# Altium project PCB_Project1.PrjPCB
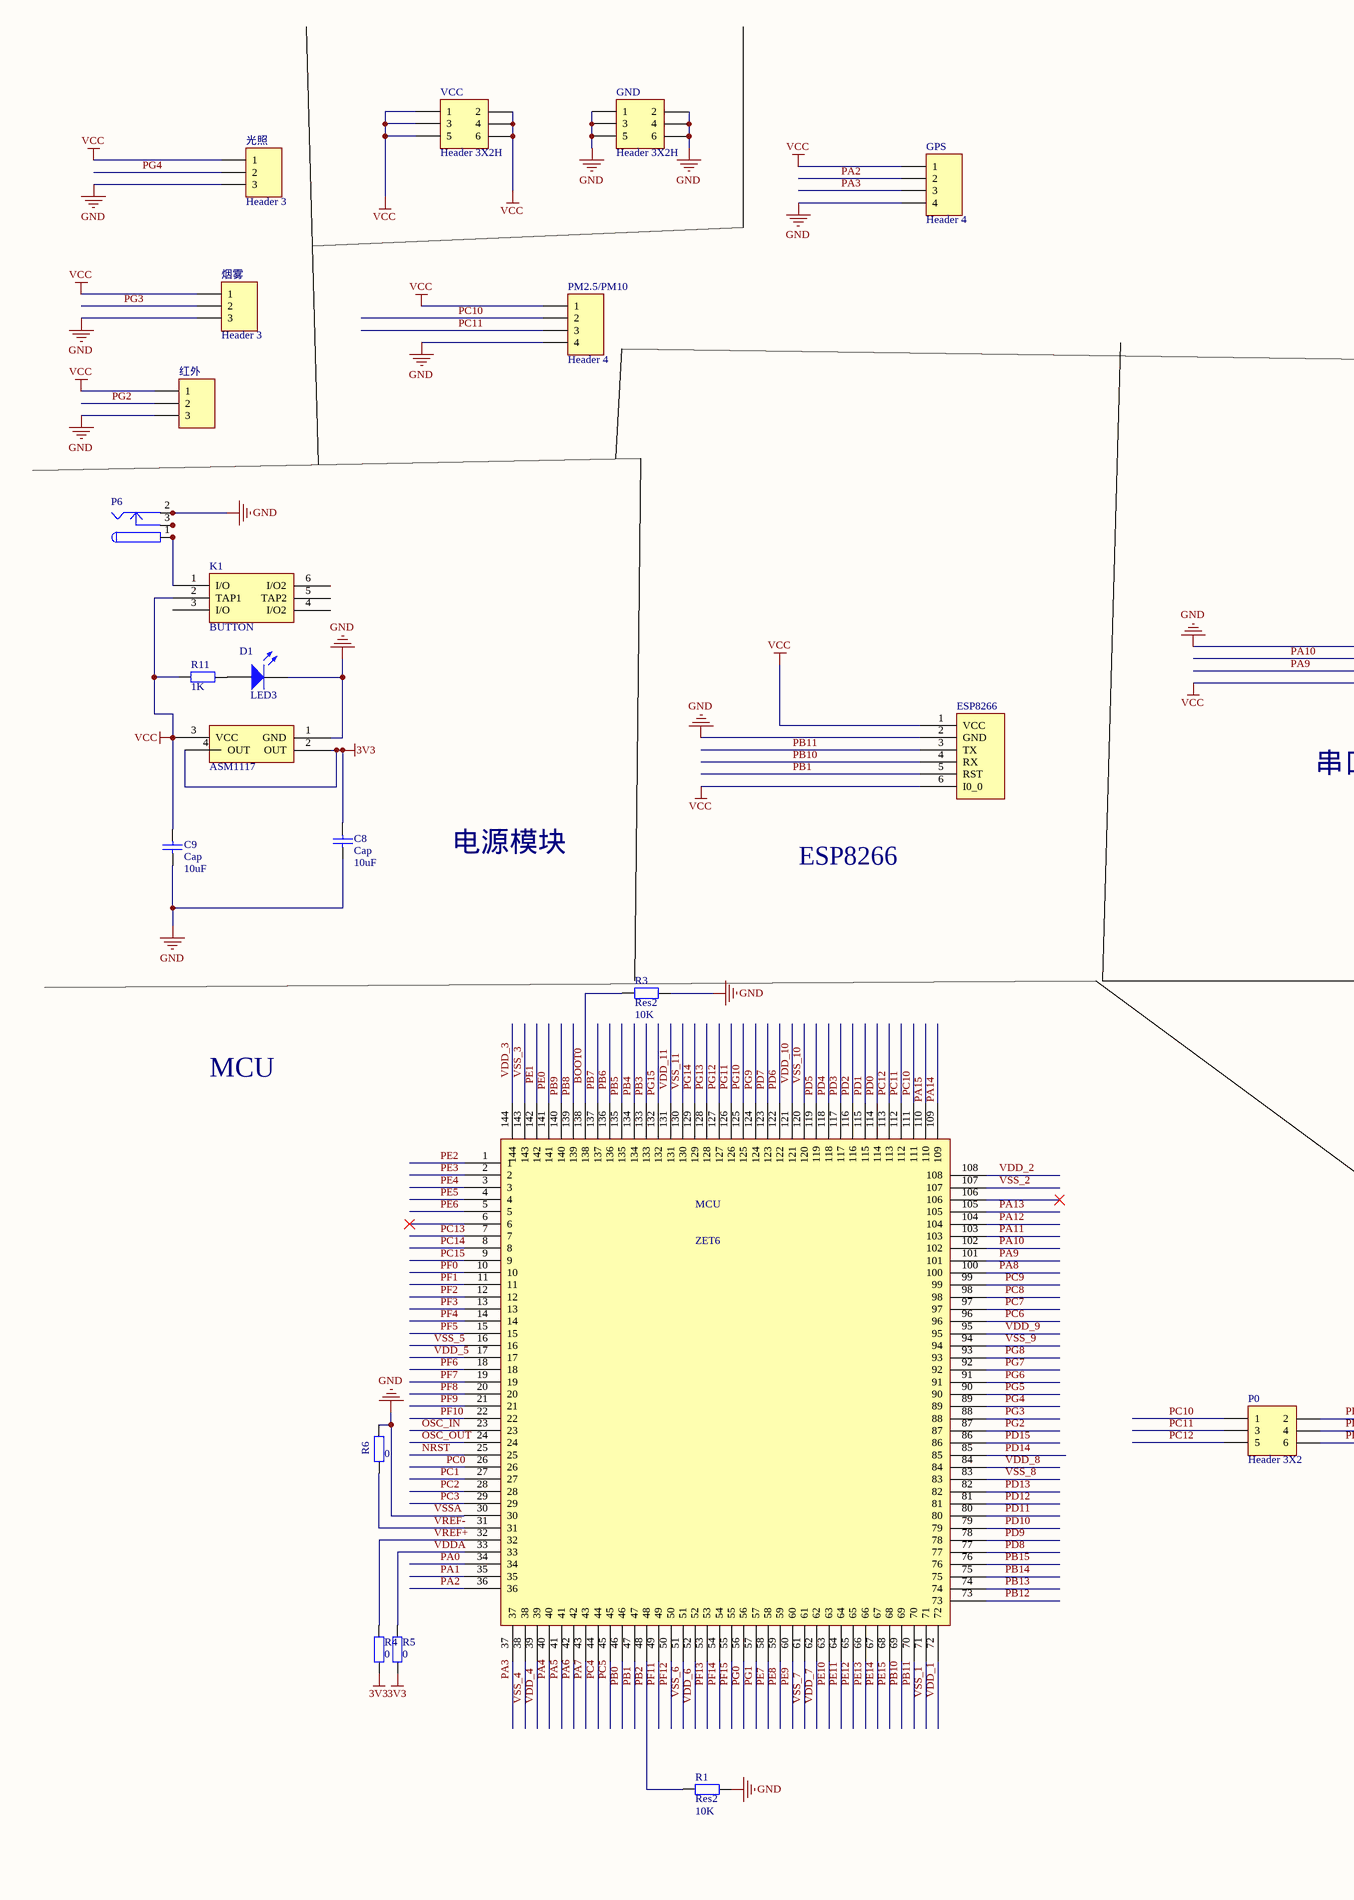
[diagram p0: 1.SchDoc, left]
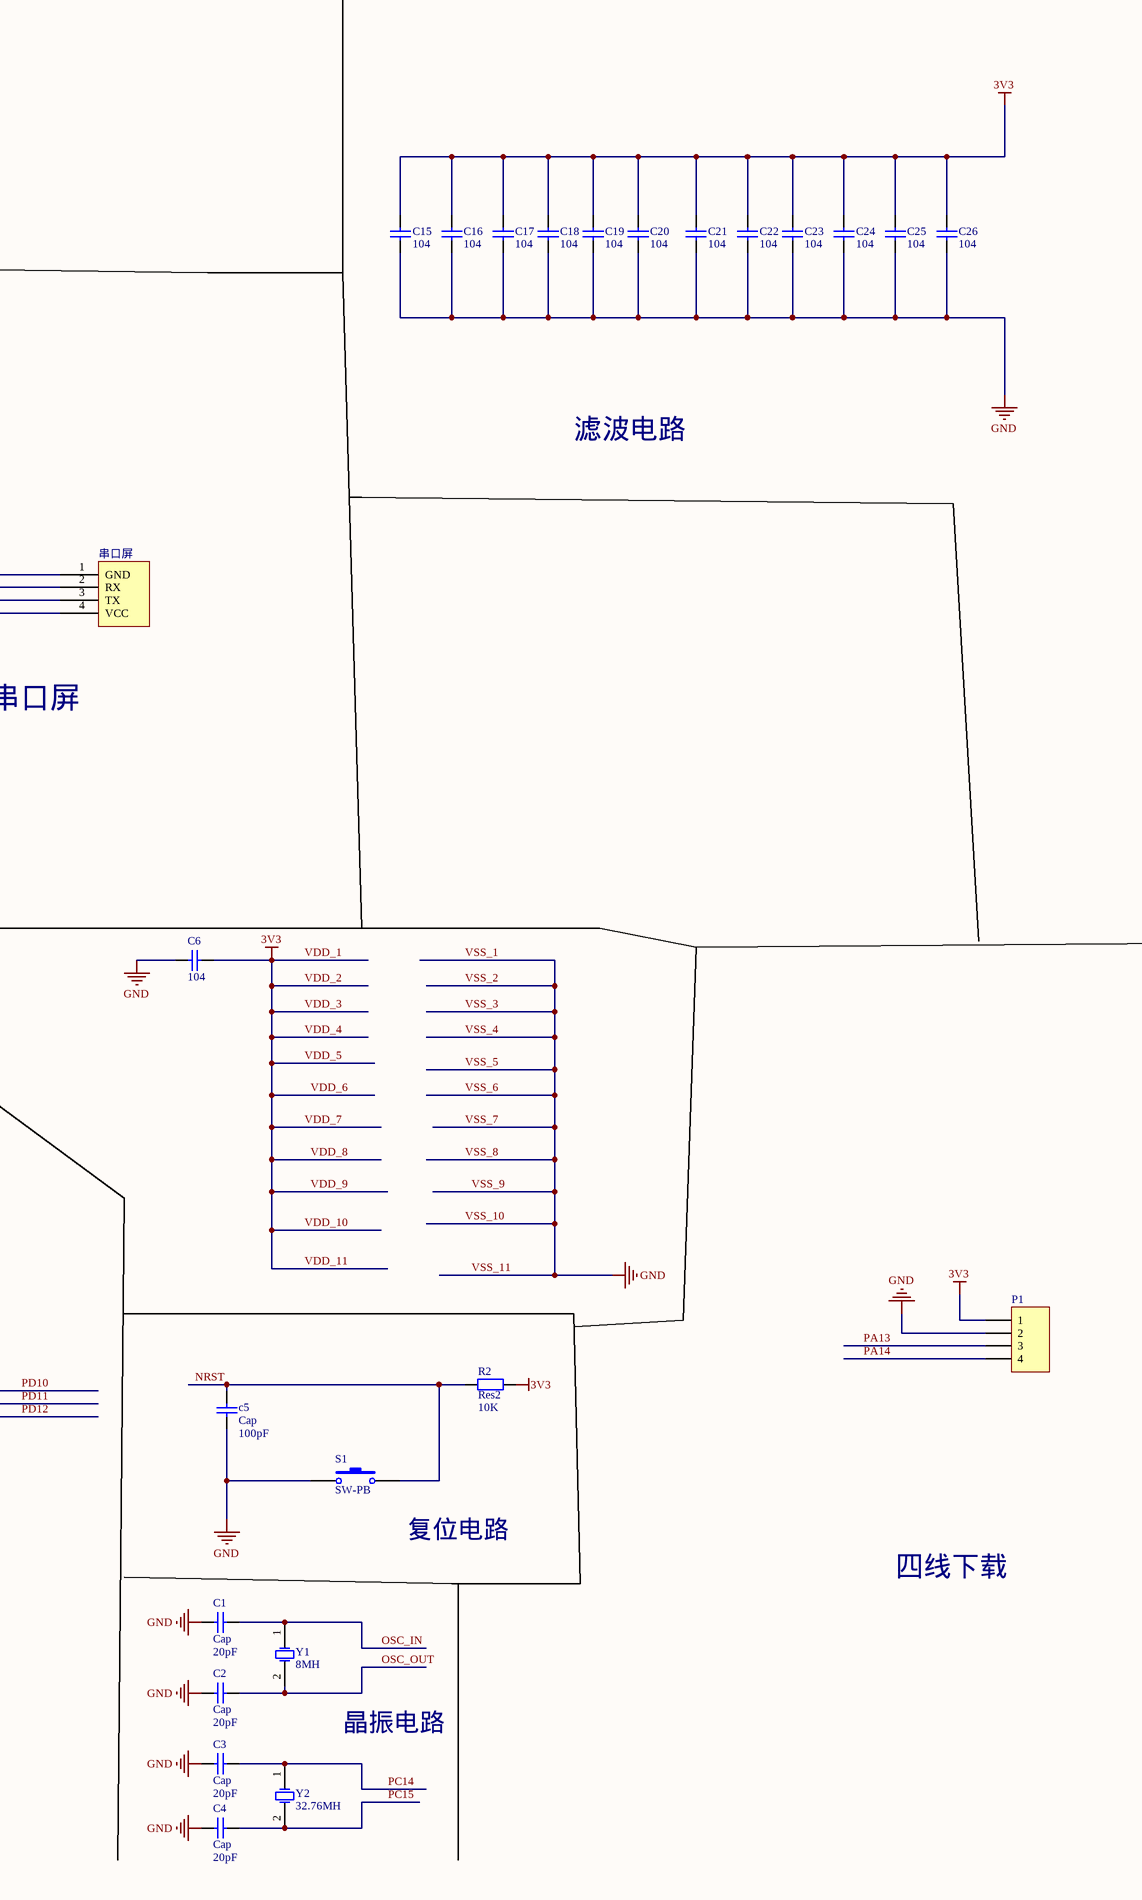
[diagram p1: 1.SchDoc, right]
1 sheet, 46 parts. Net scope: global (net labels, ports and power ports of the same name join across sheets).
Board file: PCB1.PcbDoc

## Sheet 1.SchDoc
size A2

### Parts
*  ASM1117  [SOT-223]
C1  Cap  value 20pF  [C0805]
C2  Cap  value 20pF  [C0805]
C3  Cap  value 20pF  [C0805]
C4  Cap  value 20pF  [C0805]
c5  Cap  value 100pF  [C0805]
C6  value 104  [C0805]  (hidden comment: Cap Semi)
C8  Cap  value 10uF  [C0805]
C9  Cap  value 10uF  [C0805]
C15  value 104  [C0805]  (hidden comment: Cap)
C16  value 104  [C0805]  (hidden comment: Cap)
C17  value 104  [C0805]  (hidden comment: Cap)
C18  value 104  [C0805]  (hidden comment: Cap)
C19  value 104  [C0805]  (hidden comment: Cap)
C20  value 104  [C0805]  (hidden comment: Cap)
C21  value 104  [C0805]  (hidden comment: Cap)
C22  value 104  [C0805]  (hidden comment: Cap)
C23  value 104  [C0805]  (hidden comment: Cap)
C24  value 104  [C0805]  (hidden comment: Cap)
C25  value 104  [C0805]  (hidden comment: Cap)
C26  value 104  [C0805]  (hidden comment: Cap)
D1  LED3  [RB.10]
ESP8266  A10  [HDR1X6]  (value not drawn)
GND  Header 3X2H  [HDR2X3_CEN]
GPS  Header 4  [HDR1X4]
K1  BUTTON  [BTN8.5*8.5]
P0  Header 3X2  [HDR2X3]
P1  Header 4  [HDR1X4]  (value not drawn)
P6  PWR2.5  [DCIN]  (value not drawn)
PM2.5/PM10  Header 4  [HDR1X4]
R1  Res2  value 10K  [C0805]
R2  Res2  value 10K  [C0805]
R3  Res2  value 10K  [C0805]
R4  value 0  [C0805]  (hidden comment: Res2)
R5  value 0  [C0805]  (hidden comment: Res2)
R6  value 0  [C0805]  (hidden comment: Res2)
R11  value 1K  [C0805]  (hidden comment: Res2)
S1  SW-PB  [key4]
VCC  Header 3X2H  [HDR2X3_CEN]
Y1  8MH  [XTAL1]
Y2  32.76MH  [CY-W]
ZET6  MCU  [LQFP144]
串口屏  串口屏  [HDR1X4]  (value not drawn)
光照  Header 3  [HDR1X3]
烟雾  Header 3  [HDR1X3]
红外  Header 3  [HDR1X3]  (value not drawn)

### Nets
VCC: *.3(VCC) C9.2 ESP8266.1(VCC) ESP8266.6(I0_0) GPS.1 K1.2(TAP1) PM2.5/PM10.1 R11.1 VCC.1 VCC.2 VCC.3 VCC.4 VCC.5 VCC.6 串口屏.4(VCC) 光照.1 烟雾.1 红外.1
VDD_1: *.2(OUT) *.4(OUT) C6.2 C8.2 C15.2 C16.2 C17.1 C18.2 C19.2 C20.2 C21.2 C22.2 C23.2 C24.2 C25.2 C26.2 P1.1 R2.2 R4.1 R5.1 ZET6.17 ZET6.39 ZET6.52 ZET6.62 ZET6.72 ZET6.84 ZET6.95 ZET6.108 ZET6.121 ZET6.131 ZET6.144  [also labelled 3V3, VDD_10, VDD_11, VDD_2, VDD_3, VDD_4, VDD_5, VDD_6, VDD_7, VDD_8, VDD_9]
VSS_1: *.1(GND) C1.1 C2.1 C3.1 C4.1 c5.1 C6.1 C8.1 C9.1 C15.1 C16.1 C17.2 C18.1 C19.1 C20.1 C21.1 C22.1 C23.1 C24.1 C25.1 C26.1 D1.2(K) ESP8266.2(GND) GND.1 GND.2 GND.3 GND.4 GND.5 GND.6 GPS.4 P1.2 P6.2 P6.2A P6.2B PM2.5/PM10.4 R1.2 R3.2 R6.2 S1.1 ZET6.16 ZET6.30 ZET6.38 ZET6.51 ZET6.61 ZET6.71 ZET6.83 ZET6.94 ZET6.107 ZET6.120 ZET6.130 ZET6.143 串口屏.1(GND) 光照.3 烟雾.3 红外.3  [also labelled GND, VSS_10, VSS_11, VSS_2, VSS_3, VSS_4, VSS_5, VSS_6, VSS_7, VSS_8, VSS_9, VSSA]
BOOT0: R3.1 ZET6.138
NRST: c5.2 R2.1 S1.2 ZET6.25
OSC_IN: C1.2 Y1.1(OSC1) ZET6.23
OSC_OUT: C2.2 Y1.2(OSC2) ZET6.24
PA0: ZET6.34
PA1: ZET6.35
PA2: GPS.2 ZET6.36
PA3: GPS.3 ZET6.37
PA4: ZET6.40
PA5: ZET6.41
PA6: ZET6.42
PA7: ZET6.43
PA8: ZET6.100
PA9: ZET6.101 串口屏.3(TX)
PA10: ZET6.102 串口屏.2(RX)
PA11: ZET6.103
PA12: ZET6.104
PA13: P1.3 ZET6.105
PA14: P1.4 ZET6.109
PA15: ZET6.110
PB0: ZET6.46
PB1: ESP8266.5(RST) ZET6.47
PB2: R1.1 ZET6.48
PB3: ZET6.133
PB4: ZET6.134
PB5: ZET6.135
PB6: ZET6.136
PB7: ZET6.137
PB8: ZET6.139
PB9: ZET6.140
PB10: ESP8266.4(RX) ZET6.69
PB11: ESP8266.3(TX) ZET6.70
PB12: ZET6.73
PB13: ZET6.74
PB14: ZET6.75
PB15: ZET6.76
PC0: ZET6.26
PC1: ZET6.27
PC2: ZET6.28
PC3: ZET6.29
PC4: ZET6.44
PC5: ZET6.45
PC6: ZET6.96
PC7: ZET6.97
PC8: ZET6.98
PC9: ZET6.99
PC10: P0.1 PM2.5/PM10.2 ZET6.111
PC11: P0.3 PM2.5/PM10.3 ZET6.112
PC12: P0.5 ZET6.113
PC13: ZET6.7
PC14: C3.2 Y2.1(OSC1) ZET6.8
PC15: C4.2 Y2.2(OSC2) ZET6.9
PD0: ZET6.114
PD1: ZET6.115
PD2: ZET6.116
PD3: ZET6.117
PD4: ZET6.118
PD5: ZET6.119
PD6: ZET6.122
PD7: ZET6.123
PD8: ZET6.77
PD9: ZET6.78
PD10: P0.2 ZET6.79
PD11: P0.4 ZET6.80
PD12: P0.6 ZET6.81
PD13: ZET6.82
PD14: ZET6.85
PD15: ZET6.86
PE0: ZET6.141
PE1: ZET6.142
PE2: ZET6.1
PE3: ZET6.2
PE4: ZET6.3
PE5: ZET6.4
PE6: ZET6.5
PE7: ZET6.58
PE8: ZET6.59
PE9: ZET6.60
PE10: ZET6.63
PE11: ZET6.64
PE12: ZET6.65
PE13: ZET6.66
PE14: ZET6.67
PE15: ZET6.68
PF0: ZET6.10
PF1: ZET6.11
PF2: ZET6.12
PF3: ZET6.13
PF4: ZET6.14
PF5: ZET6.15
PF6: ZET6.18
PF7: ZET6.19
PF8: ZET6.20
PF9: ZET6.21
PF10: ZET6.22
PF11: ZET6.49
PF12: ZET6.50
PF13: ZET6.53
PF14: ZET6.54
PF15: ZET6.55
PG0: ZET6.56
PG1: ZET6.57
PG2: ZET6.87 红外.2
PG3: ZET6.88 烟雾.2
PG4: ZET6.89 光照.2
PG5: ZET6.90
PG6: ZET6.91
PG7: ZET6.92
PG8: ZET6.93
PG9: ZET6.124
PG10: ZET6.125
PG11: ZET6.126
PG12: ZET6.127
PG13: ZET6.128
PG14: ZET6.129
PG15: ZET6.132
VDDA: R5.2 ZET6.33
VREF+: R4.2 ZET6.32
VREF-: R6.1 ZET6.31
NetD1_1: D1.1(A) R11.2
NetK1_1: K1.1(I/O) P6.1 P6.1A P6.1B
NetP6_3: P6.3 P6.3A P6.3B

Not connected (* = marked no-connect by the designer): K1 3(I/O) 4(I/O2) 5(TAP2) 6(I/O2); ZET6 6* 106*

### Notes on the sheet
- 滤波电路
- 串口屏
- 电源模块
- ESP8266
- MCU
- (near S1) 复位电路
- 四线下载
- 晶振电路

### Library data of the parts
C1-C4 c5 C8 C9 C15-C26 = Cap: Capacitor; Published: 8-Jun-2000; LatestRevisionDate: 17-Jul-2002; LatestRevisionNote: Re-released for DXP Platform.; PackageReference: RAD-0.3; Publisher: Altium Limited; PackageDescription: Radial Cap, Thru-Hole; 2 Leads; 0.3 in Pin Spacing
C6 = Cap Semi: Capacitor (Semiconductor SIM Model); Published: 8-Jun-2000; LatestRevisionDate: 29-May-2009; LatestRevisionNote: IPC-7351 Footprint Added.; PackageReference: C1206; Publisher: Altium Limited; PackageDescription: Chip Capacitor
D1 = LED3: Typical BLUE SiC LED; Published: 8-Jun-2000; LatestRevisionDate: 17-Dec-2003; LatestRevisionNote: PCB Footprint replaced.; DatasheetVersion: 16-Apr-2002; PackageVersion: 16-Apr-2002; PackageReference: 3.5X2.8X1.9; Publisher: Altium Limited; PackageDescription: SM LED; 2 C-Bend Leads; Body 3.5 x 2.8 x 1.9 mm, inc leads (LxWxH typ)
ESP8266 ZET6 = Component_1
GND VCC = Header 3X2H: Header, 3-Pin, Dual row, Right Angle; LatestRevisionDate: 17-Jul-2002; LatestRevisionNote: Re-released for DXP Platform.; Publisher: Altium Limited
GPS P1 PM2.5/PM10 = Header 4: Header, 4-Pin; LatestRevisionDate: 17-Jul-2002; LatestRevisionNote: Re-released for DXP Platform.; Publisher: Altium Limited
P0 = Header 3X2: Header, 3-Pin, Dual row; LatestRevisionDate: 17-Jul-2002; LatestRevisionNote: Re-released for DXP Platform.; Publisher: Altium Limited
P6 = PWR2.5: Low Voltage Power Supply Connector; Published: 17-Dec-2003; DatasheetDocument: 09-May-2002; Publisher: Altium Limited; ComponentLink1Description: Manufacturer Link; ComponentLink1URL: http://domino.kycon.com/internet/Products.html
R1-R6 R11 = Res2: Resistor; Published: 8-Jun-2000; LatestRevisionDate: 17-Jul-2002; LatestRevisionNote: Re-released for DXP Platform.; PackageReference: AXIAL-0.4; Publisher: Altium Limited; PackageDescription: Axial Device, Thru-Hole; 2 Leads; 0.4 in Pin Spacing
S1 = SW-PB: Switch; Published: 24-Mar-1999; LatestRevisionDate: 17-Jul-2002; LatestRevisionNote: Re-released for DXP Platform.; PackageReference: SPST-2; Publisher: Altium Limited; PackageDescription: Switch; 2 Leads
Y1 Y2 = XTAL: Crystal Oscillator; Published: 8-Jun-2000; LatestRevisionDate: 17-Jul-2002; LatestRevisionNote: Re-released for DXP Platform.; PackageReference: R38; Publisher: Altium Limited; PackageDescription: Crystal, Thru-Hole; 2 Leads; Body 3.1 x 8.2 mm (Dia.xH)
光照 烟雾 红外 = Header 3: Header, 3-Pin; LatestRevisionDate: 17-Jul-2002; LatestRevisionNote: Re-released for DXP Platform.; Publisher: Altium Limited